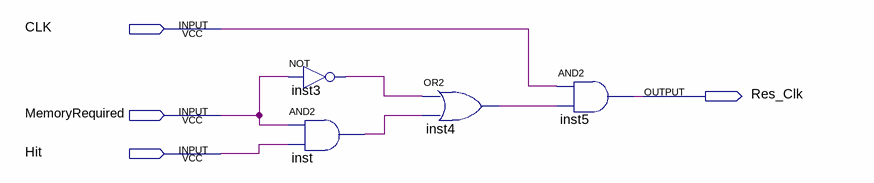
[diagram p0: schematic sheet]
// Quartus schematic СlkLoadToReg.bdf as structural Verilog: 4 symbols, 4 pins
module \СlkLoadToReg  (
  input  CLK,
  input  MemoryRequired,
  input  Hit,
  output Res_Clk
);

  wire inst3_out, inst4_out, inst_out;

  not inst3 (inst3_out, MemoryRequired);
  and inst (inst_out, MemoryRequired, Hit);
  or inst4 (inst4_out, inst3_out, inst_out);
  and inst5 (Res_Clk, CLK, inst4_out);
endmodule
